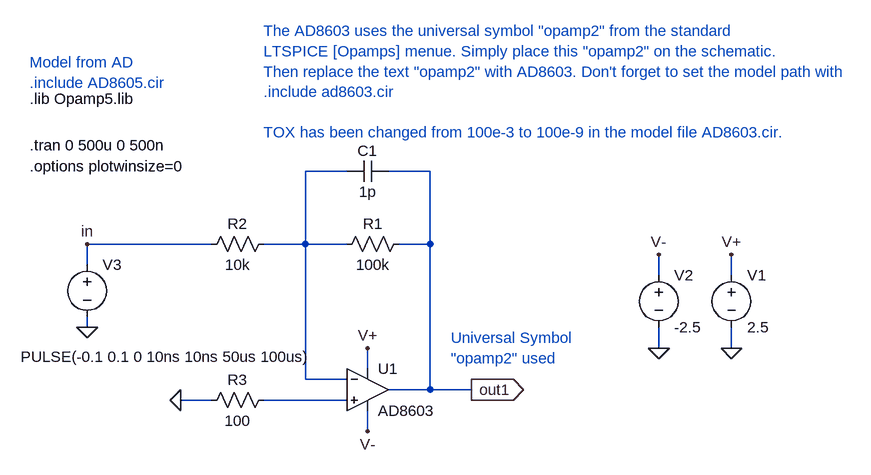
[diagram p0: schematic AD8603_test.asc]
AD8603_test.asc, the LTspice schematic file:
Version 4
SHEET 1 1200 1172
WIRE 96 -128 32 -128
WIRE 224 -128 160 -128
WIRE -112 -16 -304 -16
WIRE 32 -16 32 -128
WIRE 32 -16 -32 -16
WIRE 96 -16 32 -16
WIRE 224 -16 224 -128
WIRE 224 -16 176 -16
WIRE -304 16 -304 -16
WIRE 576 32 576 0
WIRE 688 32 688 0
WIRE -304 112 -304 96
WIRE 576 144 576 112
WIRE 688 144 688 112
WIRE 128 176 128 144
WIRE 32 192 32 -16
WIRE 96 192 32 192
WIRE 224 208 224 -16
WIRE 224 208 160 208
WIRE 288 208 224 208
WIRE -112 224 -160 224
WIRE 96 224 -32 224
WIRE 128 272 128 240
FLAG 688 144 0
FLAG -160 224 0
FLAG -304 112 0
FLAG 288 208 out1
IOPIN 288 208 Out
FLAG 576 144 0
FLAG -304 -16 in
FLAG 128 144 V+
FLAG 128 272 V-
FLAG 576 0 V-
FLAG 688 0 V+
SYMBOL voltage 688 16 R0
WINDOW 123 0 0 Left 0
WINDOW 39 0 0 Left 0
SYMATTR InstName V1
SYMATTR Value 2.5
SYMBOL voltage 576 16 R0
WINDOW 123 0 0 Left 0
WINDOW 39 0 0 Left 0
SYMATTR InstName V2
SYMATTR Value -2.5
SYMBOL res -16 -32 R90
WINDOW 0 0 56 VBottom 0
WINDOW 3 32 56 VTop 0
SYMATTR InstName R2
SYMATTR Value 10k
SYMBOL voltage -304 0 R0
WINDOW 3 -102 157 Left 0
WINDOW 123 0 0 Left 0
WINDOW 39 0 0 Left 0
SYMATTR Value PULSE(-0.1 0.1 0 10ns 10ns 50us 100us)
SYMATTR InstName V3
SYMBOL cap 160 -144 R90
WINDOW 0 0 32 VBottom 0
WINDOW 3 32 32 VTop 0
SYMATTR InstName C1
SYMATTR Value 1p
SYMBOL res 192 -32 R90
WINDOW 0 0 56 VBottom 0
WINDOW 3 32 56 VTop 0
SYMATTR InstName R1
SYMATTR Value 100k
SYMBOL Opamps\\opamp2 128 144 R0
SYMATTR InstName U1
SYMATTR Value AD8603
SYMBOL res -128 240 R270
WINDOW 0 32 56 VTop 0
WINDOW 3 0 56 VBottom 0
SYMATTR InstName R3
SYMATTR Value 100
TEXT -392 -168 Left 0 !.tran 0 500u 0 500n
TEXT 256 128 Left 0 ;Universal Symbol \n"opamp2" used
TEXT -392 -264 Left 0 ;.include AD8605.cir
TEXT -32 -344 Left 0 ;The AD8603 uses the universal symbol "opamp2" from the standard \nLTSPICE [Opamps] menue. Simply place this "opamp2" on the schematic. \nThen replace the text "opamp2" with AD8603. Don't forget to set the model path with\n.include ad8603.cir\n \nTOX has been changed from 100e-3 to 100e-9 in the model file AD8603.cir.
TEXT -392 -136 Left 0 !.options plotwinsize=0
TEXT -392 -296 Left 0 ;Model from AD
TEXT -392 -240 Left 0 !.lib Opamp5.lib

The netlist it stands for:
* AD8603_test.asc
V1 V+ 0 2.5
V2 V- 0 -2.5
R2 N001 in 10k
V3 in 0 PULSE(-0.1 0.1 0 10ns 10ns 50us 100us)
C1 out1 N001 1p
R1 out1 N001 100k
XU1 N002 N001 V+ V- out1 AD8603  ; pins In+ In- V+ V- OUT
R3 0 N002 100
.tran 0 500u 0 500n
* Universal Symbol
* "opamp2" used
* .include AD8605.cir
* The AD8603 uses the universal symbol "opamp2" from the standard
* LTSPICE [Opamps] menue. Simply place this "opamp2" on the schematic.
* Then replace the text "opamp2" with AD8603. Don't forget to set the model path with
* .include ad8603.cir
* TOX has been changed from 100e-3 to 100e-9 in the model file AD8603.cir.
.options plotwinsize=0
* Model from AD
.lib Opamp5.lib
.backanno
.end